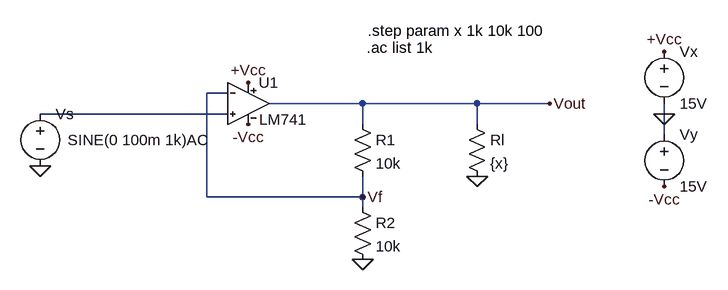
[diagram p0: schematic VCVS.asc]
VCVS.asc, the LTspice schematic file:
Version 4
SHEET 1 904 680
WIRE 160 144 128 144
WIRE 368 160 224 160
WIRE 544 160 368 160
WIRE 656 160 544 160
WIRE 160 176 -128 176
WIRE 832 176 832 160
WIRE 368 192 368 160
WIRE 544 192 544 160
WIRE 832 208 832 176
WIRE 128 304 128 144
WIRE 368 304 368 272
WIRE 368 304 128 304
WIRE 368 320 368 304
FLAG 192 128 +Vcc
FLAG 192 192 -Vcc
FLAG 832 176 0
FLAG 832 80 +Vcc
FLAG 832 288 -Vcc
FLAG 368 400 0
FLAG 544 272 0
FLAG -128 256 0
FLAG 656 160 Vout
FLAG 368 304 Vf
SYMBOL LM741 192 96 R0
SYMATTR InstName U1
SYMBOL voltage 832 64 R0
SYMATTR InstName Vx
SYMATTR Value 15V
SYMBOL voltage 832 192 R0
SYMATTR InstName Vy
SYMATTR Value 15V
SYMBOL res 352 176 R0
SYMATTR InstName R1
SYMATTR Value 10k
SYMBOL res 352 304 R0
SYMATTR InstName R2
SYMATTR Value 10k
SYMBOL res 528 176 R0
SYMATTR InstName Rl
SYMATTR Value {x}
SYMBOL voltage -128 160 R0
WINDOW 3 42 56 Left 2
WINDOW 123 24 124 Left 2
WINDOW 39 0 0 Left 2
SYMATTR Value SINE(0 100m 1k)AC
SYMATTR InstName Vs
TEXT 374 74 Left 2 !.ac list 1k
TEXT 376 48 Left 2 !.step param x 1k 10k 100

The netlist it stands for:
* VCVS.asc
XU1 N001 Vf +Vcc -Vcc Vout LM741  ; pins In+ In- V+ V- OUT
Vx +Vcc 0 15V
Vy 0 -Vcc 15V
R1 Vout Vf 10k
R2 Vf 0 10k
Rl Vout 0 {x}
Vs N001 0 SINE(0 100m 1k)AC
.ac list 1k
.step param x 1k 10k 100
.lib LM741.lib
.backanno
.end